# EAGLE design main (EAGLE 7.5.0)
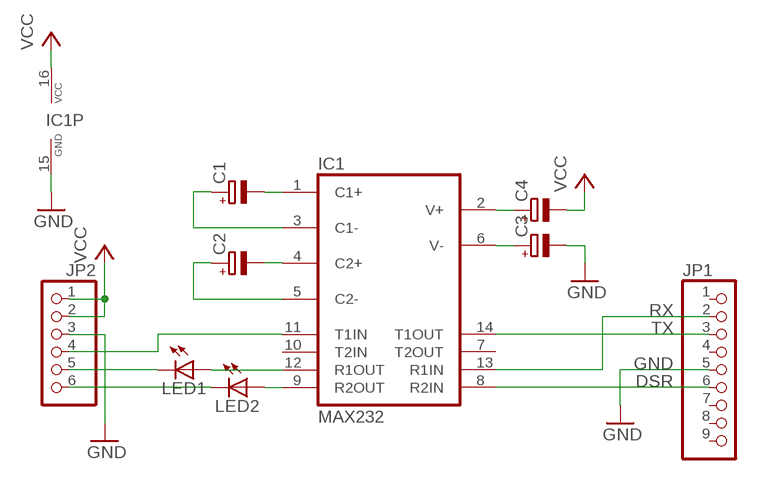
[diagram p0: schematic, sheet 1]

## Parts
C1  CPOL-EUB45181A  [B45181A]
C2  CPOL-EUB45181A  [B45181A]
C3  CPOL-EUB45181A  [B45181A]
C4  CPOL-EUB45181A  [B45181A]
IC1  MAX232  [DIL16]
JP1  PINHD-1X9  [1X09]
JP2  PINHD-1X6  [1X06]
LED1  LED3MM  [LED3MM]
LED2  LED3MM  [LED3MM]

## Nets
DSR: IC1.8(R2IN) JP1.6
GND: C3.- IC1.15(GND) JP1.5 JP2.3
GPIO18: JP2.6 LED2.K(C)
N$1: C3.+ IC1.6(V-)
N$2: C4.+ IC1.2(V+)
N$3: C1.+ IC1.3(C1-)
N$4: C1.- IC1.1(C1+)
N$5: C2.+ IC1.5(C2-)
N$6: C2.- IC1.4(C2+)
N$7: IC1.12(R1OUT) LED1.A
N$8: IC1.9(R2OUT) LED2.A
RX: IC1.13(R1IN) JP1.2
RXD: JP2.5 LED1.K(C)
TX: IC1.14(T1OUT) JP1.3
TXD: IC1.11(T1IN) JP2.4
VCC: C4.- IC1.16(VCC) JP2.1 JP2.2
Unconnected: IC1.7(T2OUT) IC1.10(T2IN) JP1.1 JP1.4 JP1.7 JP1.8 JP1.9

## Library data of the parts
C1-C4 = rcl:CPOL-EU: POLARIZED CAPACITOR, European symbol
IC1 = maxim:MAX232: RS232 TRANSCEIVER; MF: MAXIM; MPN: MAX232ACPE+; OC_FARNELL: 9723773; OC_NEWARK: 68K4544
JP1 = pinhead:PINHD-1X9: PIN HEADER
JP2 = pinhead:PINHD-1X6: PIN HEADER
LED1 LED2 = led:LED: LED OSRAM: - CHIPLED LG R971, LG N971, LY N971, LG Q971, LY Q971, LO R971, LY R971 LH N974, LH R974 LS Q976, LO Q976, LY Q976 LO Q996 - Hyper CHIPLED LW Q18S LB Q993, LB Q99A, LB R99A - SideLED LS A670, LO A670, LY A670, LG A670, LP A670 LB A673, LV A673, LT A673, LW A673 LH A674 LY A675 LS A676, LA A676, LO A676, LY A676, LW A676 LS A679, LY A679, LG A679 - Hyper Micro SIDELED® LS Y876, LA Y876, LO Y876, LY Y876 LT Y87S - SmartLED LW L88C, LW L88S LB L89C, LB L89S, LG L890 LS L89K, LO L89K, LY L89K LS L896, LA L896, LO L896, LY L896 - TOPLED LS T670, LO T670, LY T670, LG T670, LP T670 LSG T670, LSP T670, LSY T670, LOP T670, LYG T670 LG T671, LOG T671, LSG T671 LB T673, LV T673, LT T673, LW T673 LH T674 LS T676, LA T676, LO T676, LY T676, LB T676, LH T676, LSB T676, LW T676 LB T67C, LV T67C, LT T67C, LS T67K, LO T67K, LY T67K, LW E67C LS E67B, LA E67B, LO E67B, LY E67B, LB E67C, LV E67C, LT E67C LW T67C LS T679, LY T679, LG T679 LS T770, LO T770, LY T770, LG T770, LP T770 LB T773, LV T773, LT T773, LW T773 LH T774 LS E675, LA E675, LY E675, LS T675 LS T776, LA T776, LO T776, LY T776, LB T776 LHGB T686 LT T68C, LB T68C - Hyper Mini TOPLED® LB M676 - Mini TOPLED Santana® LG M470 LS M47K, LO M47K, LY M47K Source: http://www.osram.convergy.de LUXEON: - LUMILED® LXK2-PW12-R00, LXK2-PW12-S00, LXK2-PW14-U00, LXK2-PW14-V00 LXK2-PM12-R00, LXK2-PM12-S00, LXK2-PM14-U00 LXK2-PE12-Q00, LXK2-PE12-R00, LXK2-PE12-S00, LXK2-PE14-T00, LXK2-PE14-U00 LXK2-PB12-K00, LXK2-PB12-L00, LXK2-PB12-M00, LXK2-PB14-N00, LXK2-PB14-P00, LXK2-PB14-Q00 LXK2-PR12-L00, LXK2-PR12-M00, LXK2-PR14-Q00, LXK2-PR14-R00 LXK2-PD12-Q00, LXK2-PD12-R00, LXK2-PD12-S00 LXK2-PH12-R00, LXK2-PH12-S00 LXK2-PL12-P00, LXK2-PL12-Q00, LXK2-PL12-R00 Source: www.luxeon.com KINGBRIGHT: KA-3528ASYC Source: www.kingbright.com

## Board
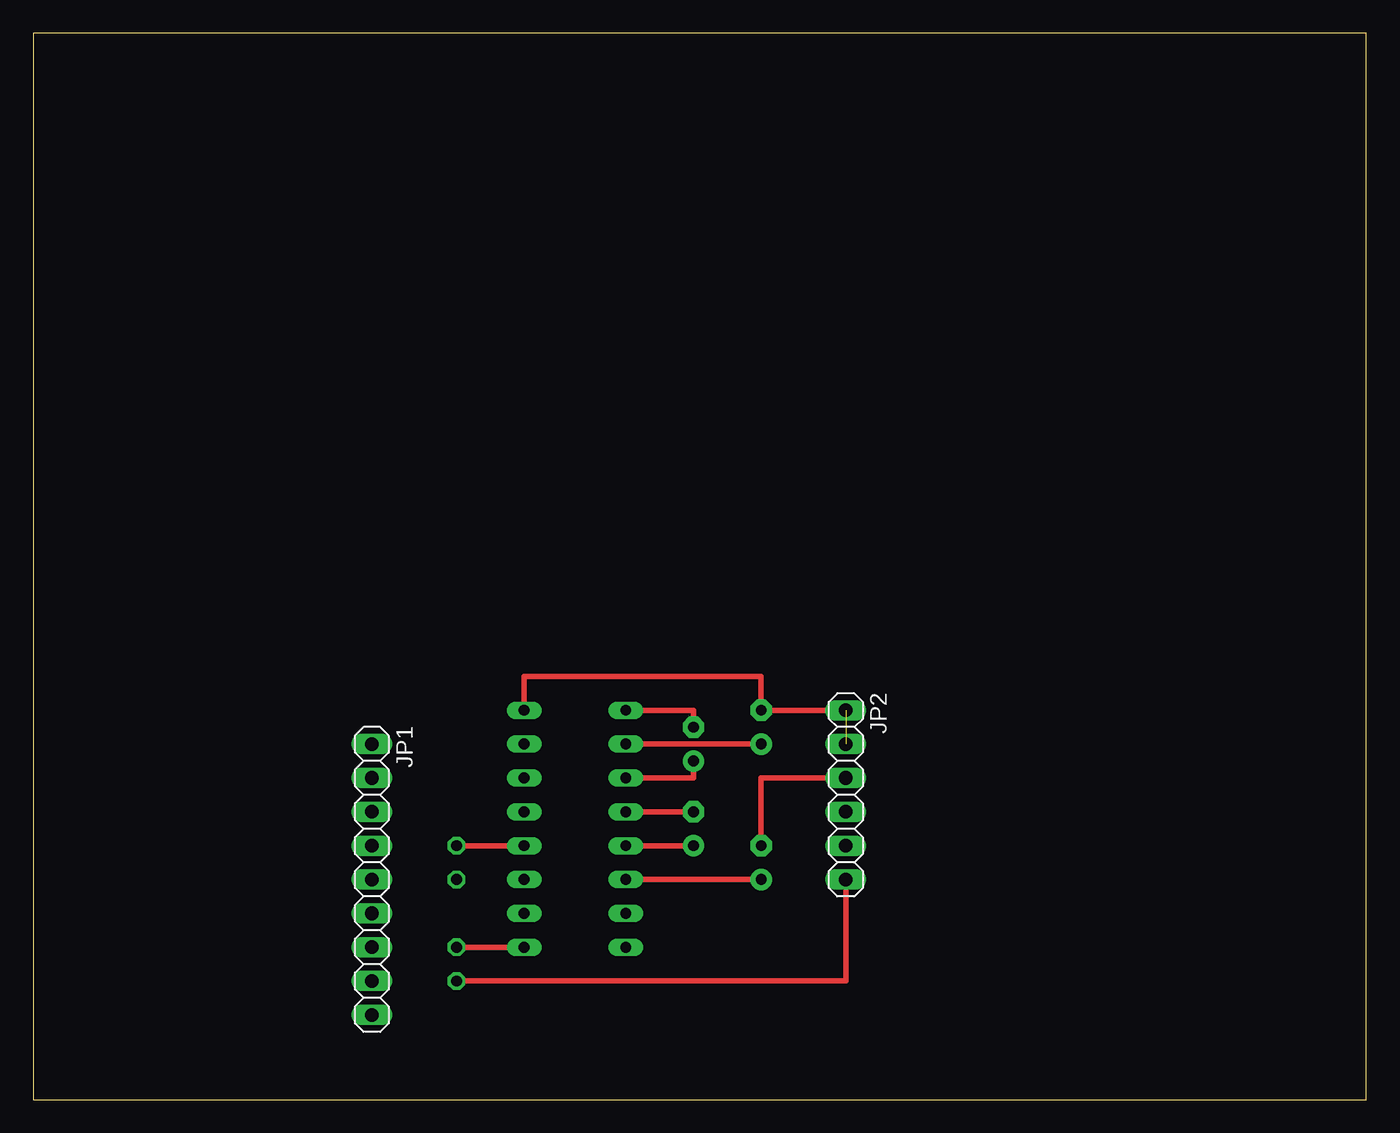
[diagram p1: board, top side]
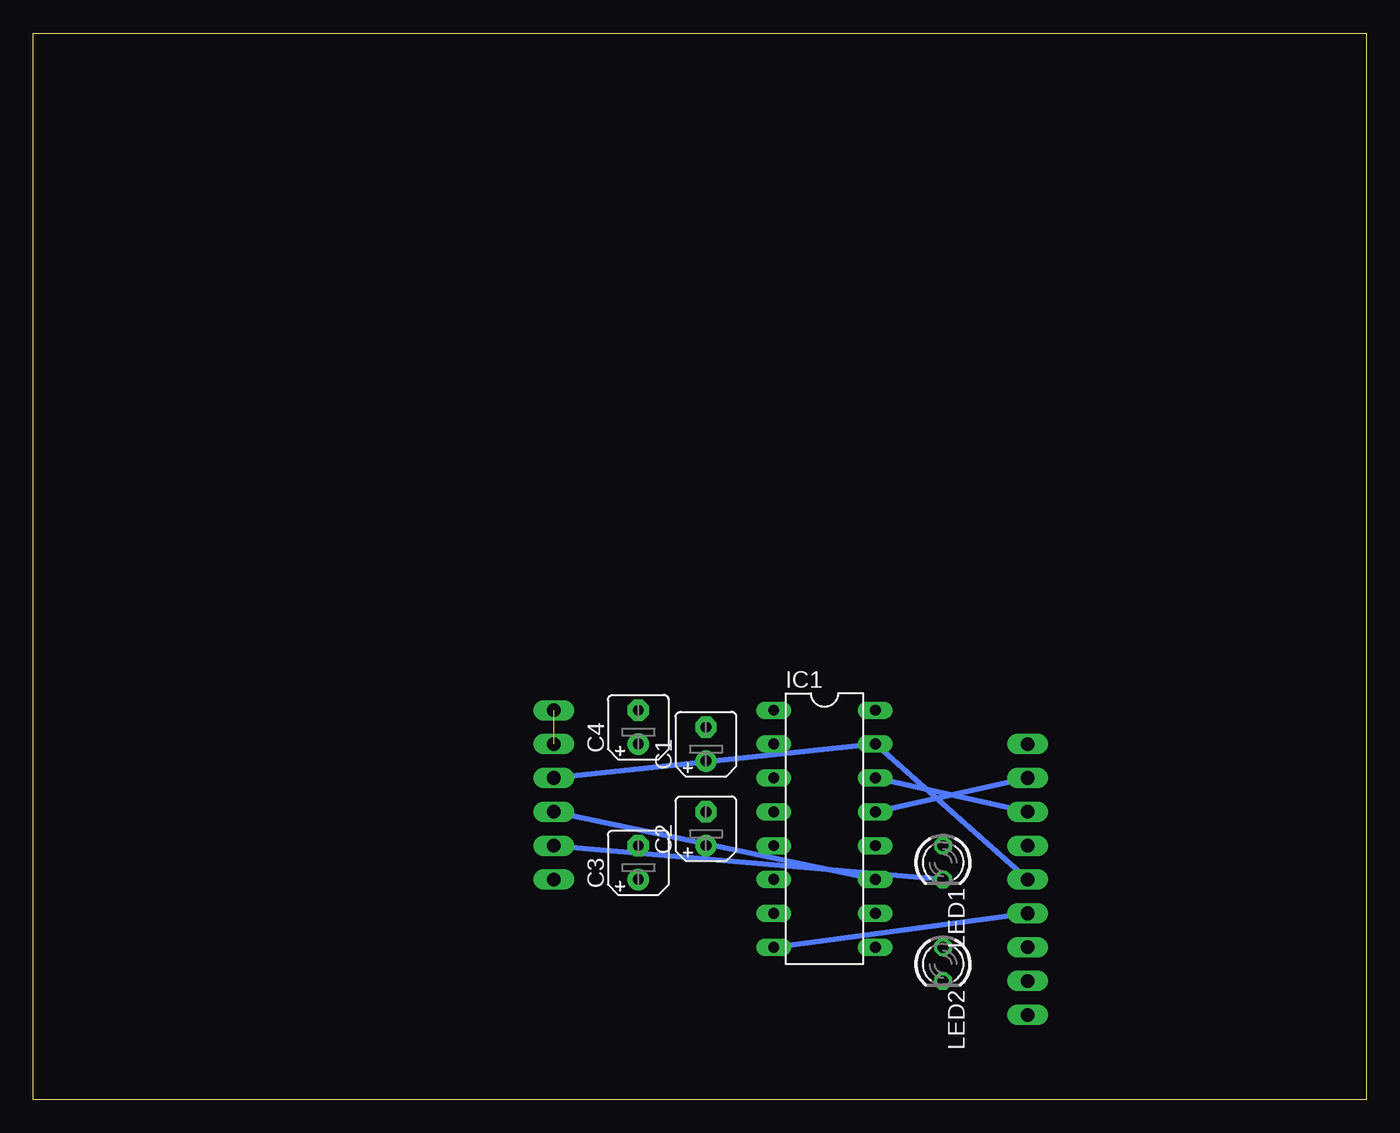
[diagram p2: board, bottom side, seen from below]

Size 100 x 80 mm. Coordinates in mm from the lower left corner, seen from the top.
Outline: 0,0 100,0 100,80 0,80 0,0
Copper layers (1*16): Top 0.035mm / dielectric 1.5mm / Bottom 0.035mm
Design rules "default": minimum track width 10mil, minimum drill 24mil, track to track 8mil, track to pad 8mil, pad to pad 8mil, via to via 8mil, smd to smd 8mil, copper to edge 40mil, drill to drill 8mil, minimum pad ring 10mil, minimum via ring 8mil, stop-mask expansion 4mil, vias tented up to drill 0mil, thermal gap 10mil

### Footprints (pad centres in the part's own frame; a part is rotated, then mirrored left to right if it is on the bottom)
B45181A = drill 0.813 pad 1.6: + -1.27,0 | drill 0.813 pad 1.6 octagon: - 1.27,0
DIL16 = drill 0.813 long: 1 -8.89,-3.81; 2 -6.35,-3.81; 3 -3.81,-3.81; 4 -1.27,-3.81; 5 1.27,-3.81; 6 3.81,-3.81; 7 6.35,-3.81; 8 8.89,-3.81; 9 8.89,3.81; 10 6.35,3.81; 11 3.81,3.81; 12 1.27,3.81; 13 -1.27,3.81; 14 -3.81,3.81; 15 -6.35,3.81; 16 -8.89,3.81
1X09 = drill 1.016 long: 1 -10.16,0; 2 -7.62,0; 3 -5.08,0; 4 -2.54,0; 5 0,0; 6 2.54,0; 7 5.08,0; 8 7.62,0; 9 10.16,0
1X06 = drill 1.016 long: 1 -6.35,0; 2 -3.81,0; 3 -1.27,0; 4 1.27,0; 5 3.81,0; 6 6.35,0
LED3MM = drill 0.813 octagon: A -1.27,0; K 1.27,0

### Placement (x,y rotation side)
C1  49.53,26.67 90 bottom
C2  49.53,20.32 90 bottom
C3  54.61,17.78 90 bottom
C4  54.61,27.94 90 bottom
IC1  40.64,20.32 270 bottom
JP1  25.4,16.51 270 top
JP2  60.96,22.86 270 top
LED1  31.75,17.78 270 bottom
LED2  31.75,10.16 270 bottom

### Tracks (layer width: path | path; a pad name or v marks a point on that pad's centre or on a via)
DSR
  Bottom 0.406: JP1.6 IC1.8
GND
  Top 0.406: C3.- 54.61,24.13 JP2.3
  Bottom 0.406: JP2.3 IC1.15 JP1.5
GPIO18
  Top 0.406: LED2.K 60.96,8.89 JP2.6
N$1
  Top 0.406: IC1.6 C3.+
N$2
  Top 0.406: C4.+ IC1.2
N$3
  Top 0.406: IC1.3 49.53,24.13 C1.+
N$4
  Top 0.406: IC1.1 49.53,29.21 C1.-
N$5
  Top 0.406: C2.+ IC1.5
N$6
  Top 0.406: IC1.4 C2.-
N$7
  Top 0.406: IC1.12 LED1.A
N$8
  Top 0.406: LED2.A IC1.9
RX
  Bottom 0.406: JP1.2 IC1.13
RXD
  Bottom 0.406: LED1.K JP2.5
TX
  Bottom 0.406: JP1.3 IC1.14
TXD
  Bottom 0.406: IC1.11 JP2.4
VCC  (1 unrouted)
  Top 0.406: IC1.16 36.83,31.75 54.61,31.75 C4.- JP2.1